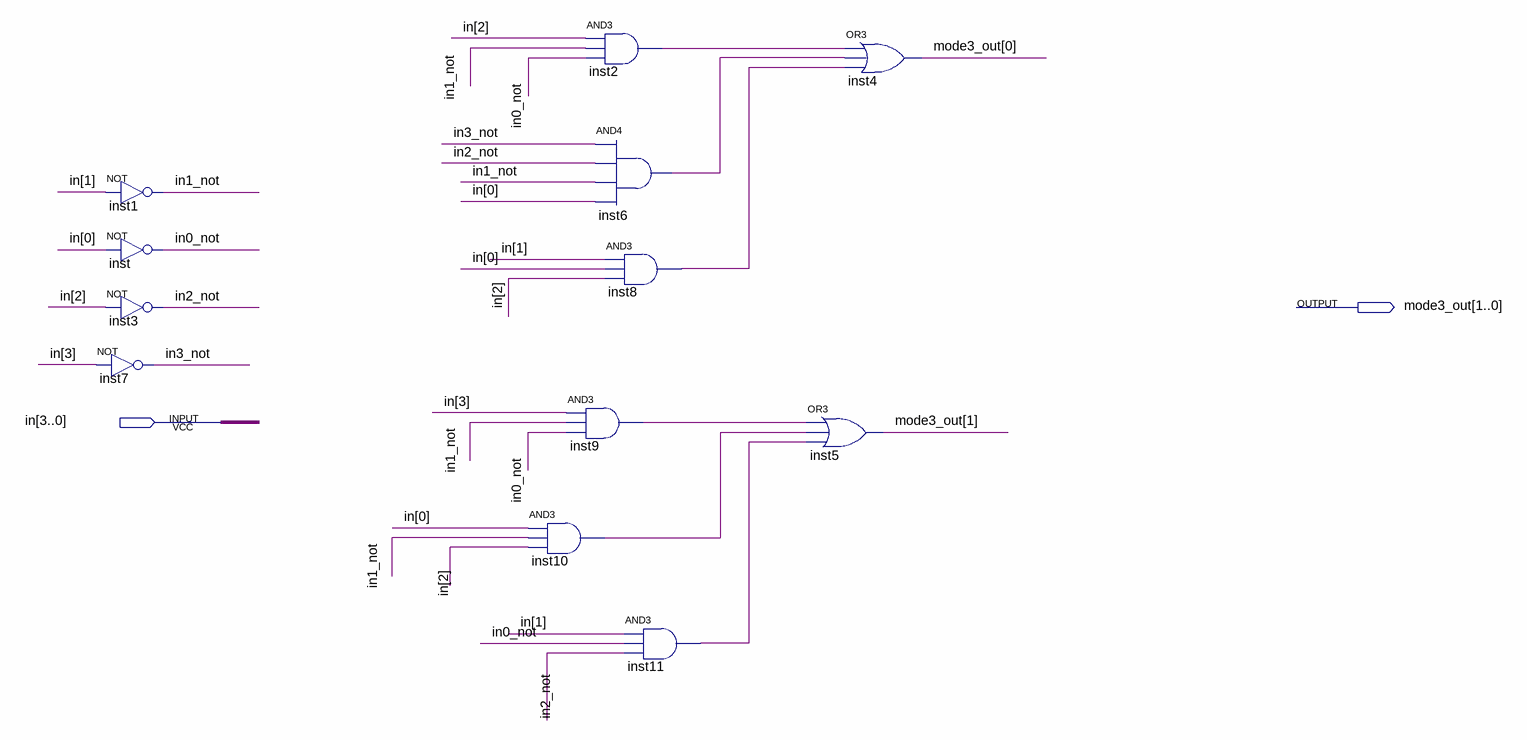
[diagram p0: schematic sheet]
// Quartus schematic mode3_digit.bdf as structural Verilog: 12 symbols, 2 pins
module mode3_digit (
  input  [3:0] in,
  output [1:0] mode3_out
);

  wire in0_not, in1_not, in2_not, in3_not, inst2_out, inst6_out, inst8_out, inst9_out, inst10_out, inst11_out;

  not inst1 (in1_not, in[1]);
  not inst (in0_not, in[0]);
  not inst3 (in2_not, in[2]);
  not inst7 (in3_not, in[3]);
  and inst9 (inst9_out, in[3], in1_not, in0_not);
  and inst10 (inst10_out, in[0], in1_not, in[2]);
  and inst2 (inst2_out, in[2], in1_not, in0_not);
  and inst6 (inst6_out, in3_not, in2_not, in1_not, in[0]);
  and inst8 (inst8_out, in[1], in[0], in[2]);
  and inst11 (inst11_out, in[1], in0_not, in2_not);
  or inst4 (mode3_out[0], inst2_out, inst6_out, inst8_out);
  or inst5 (mode3_out[1], inst9_out, inst10_out, inst11_out);
endmodule
